# EAGLE design lumy (EAGLE 6.1)
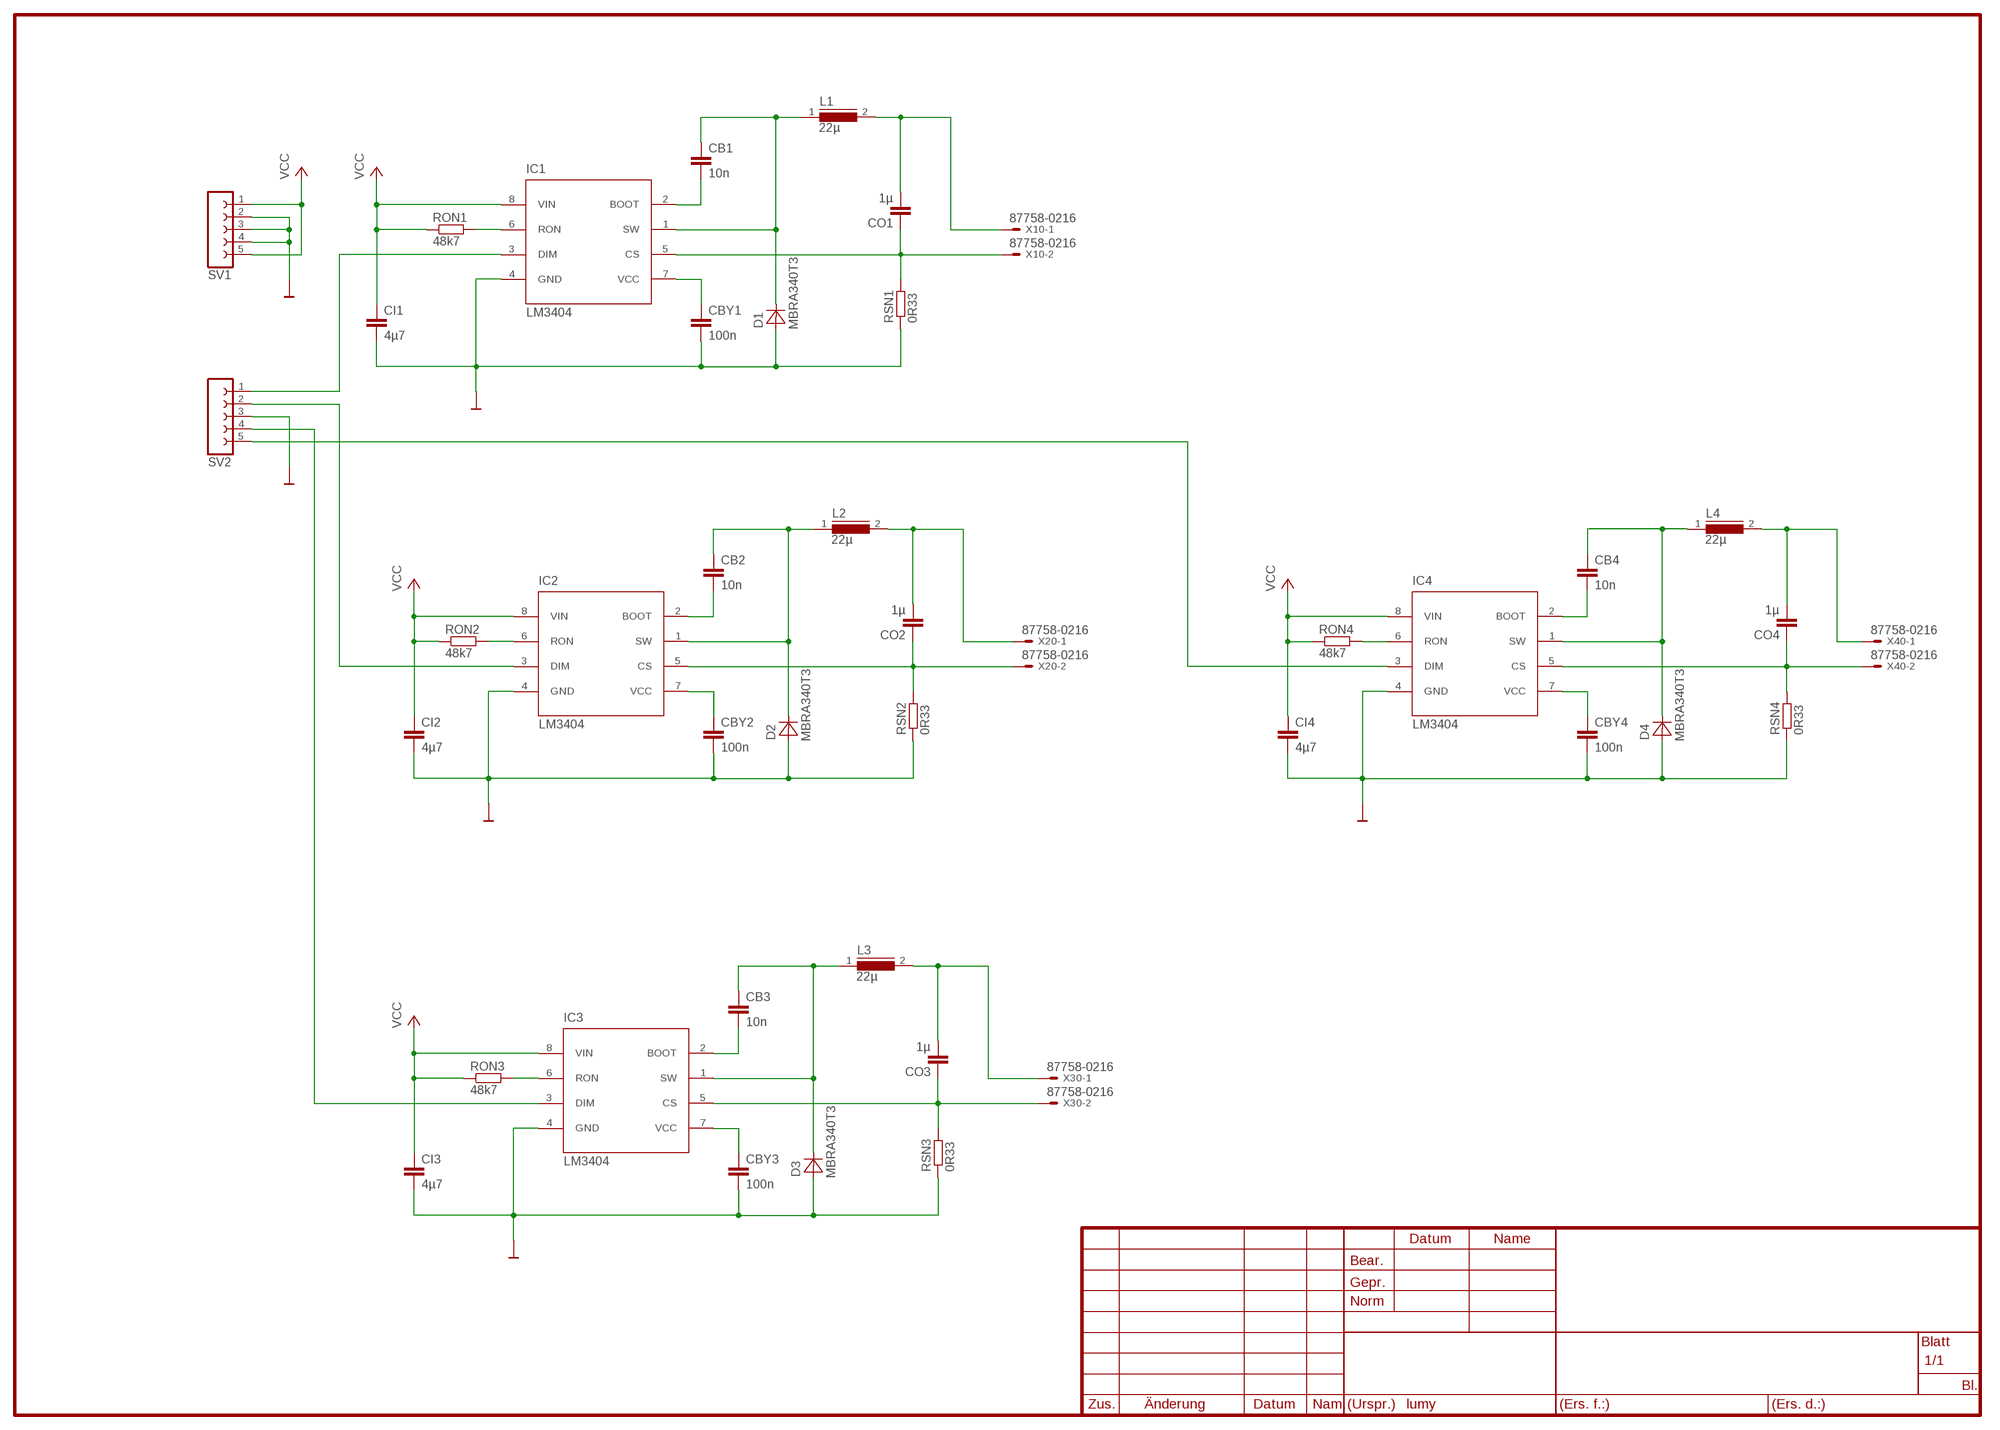
[diagram p0: schematic, sheet 1]

## Parts
CB1  10n  C-EUC0603  [C0603]
CB2  10n  C-EUC0603  [C0603]
CB3  10n  C-EUC0603  [C0603]
CB4  10n  C-EUC0603  [C0603]
CBY1  100n  C-EUC0603  [C0603]
CBY2  100n  C-EUC0603  [C0603]
CBY3  100n  C-EUC0603  [C0603]
CBY4  100n  C-EUC0603  [C0603]
CI1  4µ7  C-EUC0603  [C0603]
CI2  4µ7  C-EUC0603  [C0603]
CI3  4µ7  C-EUC0603  [C0603]
CI4  4µ7  C-EUC0603  [C0603]
CO1  1µ  C-EUC1206  [C1206]
CO2  1µ  C-EUC1206  [C1206]
CO3  1µ  C-EUC1206  [C1206]
CO4  1µ  C-EUC1206  [C1206]
D1  MBRA340T3  [SMA]
D2  MBRA340T3  [SMA]
D3  MBRA340T3  [SMA]
D4  MBRA340T3  [SMA]
IC1  LM3404  [SO08]
IC2  LM3404  [SO08]
IC3  LM3404  [SO08]
IC4  LM3404  [SO08]
L1  22µ  DR73  [DR73]
L2  22µ  DR73  [DR73]
L3  22µ  DR73  [DR73]
L4  22µ  DR73  [DR73]
RON1  48k7  R-EU_R0805  [R0805]
RON2  48k7  R-EU_R0805  [R0805]
RON3  48k7  R-EU_R0805  [R0805]
RON4  48k7  R-EU_R0805  [R0805]
RSN1  0R33  R-EU_R1206  [R1206]
RSN2  0R33  R-EU_R1206  [R1206]
RSN3  0R33  R-EU_R1206  [R1206]
RSN4  0R33  R-EU_R1206  [R1206]
SV1  FE05-1  [FE05-1]
SV2  FE05-1  [FE05-1]
X10  87758-0216  [87758-0216]
X20  87758-0216  [87758-0216]
X30  87758-0216  [87758-0216]
X40  87758-0216  [87758-0216]

## Nets
GND: CBY1.2 CBY2.2 CBY3.2 CBY4.2 CI1.2 CI2.2 CI3.2 CI4.2 D1.A D2.A D3.A D4.A IC1.4(GND) IC2.4(GND) IC3.4(GND) IC4.4(GND) RSN1.1 RSN2.1 RSN3.1 RSN4.1 SV1.2 SV1.3 SV1.4 SV2.3
N$1: IC1.6(RON) RON1.2
N$2: CB1.1 D1.C IC1.1(SW) L1.1
N$3: CBY1.1 IC1.7(VCC)
N$4: CO1.1 IC1.5(CS) RSN1.2 X10.2
N$5: CO1.2 L1.2 X10.1
N$6: CB1.2 IC1.2(BOOT)
N$7: IC1.3(DIM) SV2.1
N$8: IC2.6(RON) RON2.2
N$9: CBY2.1 IC2.7(VCC)
N$10: CO2.1 IC2.5(CS) RSN2.2 X20.2
N$11: CO2.2 L2.2 X20.1
N$12: CB2.1 D2.C IC2.1(SW) L2.1
N$13: CB2.2 IC2.2(BOOT)
N$14: IC2.3(DIM) SV2.2
N$15: IC3.6(RON) RON3.2
N$16: CBY3.1 IC3.7(VCC)
N$17: CO3.1 IC3.5(CS) RSN3.2 X30.2
N$18: CO3.2 L3.2 X30.1
N$19: CB3.1 D3.C IC3.1(SW) L3.1
N$20: CB3.2 IC3.2(BOOT)
N$21: IC3.3(DIM) SV2.4
N$23: CBY4.1 IC4.7(VCC)
N$24: CB4.2 IC4.2(BOOT)
N$25: IC4.6(RON) RON4.2
N$26: CB4.1 D4.C IC4.1(SW) L4.1
N$27: CO4.2 L4.2 X40.1
N$28: CO4.1 IC4.5(CS) RSN4.2 X40.2
N$30: IC4.3(DIM) SV2.5
VCC: CI1.1 CI2.1 CI3.1 CI4.1 IC1.8(VIN) IC2.8(VIN) IC3.8(VIN) IC4.8(VIN) RON1.1 RON2.1 RON3.1 RON4.1 SV1.1 SV1.5

## Library data of the parts
CB1-CB4 CBY1-CBY4 CI1-CI4 CO1-CO4 = rcl:C-EU: CAPACITOR, European symbol
D1-D4 = diode:MBRA340T3: Surface Mount Schottky Power Rectifier Source: http://www.onsemi.com/pub_link/Collateral/MBRA340T3-D.PDF
IC1-IC4 = national-semiconductor:LM3404: 1A Constant Current Buck Regulator for driving High Power LEDs
L1-L4 = inductors:DR73: High Power Density, High Efficiency, Shielded Inductors Source: coiltronics_dr_series.pdf
RON1-RON4 RSN1-RSN4 = rcl:R-EU_: RESISTOR, European symbol
SV1 SV2 = con-lsta:FE05-1: FEMALE HEADER; OC_FARNELL: unknown; OC_NEWARK: unknown
X10 X20 X30 X40 = con-molex:87758-0216: 2 Pin - 2mm Dual Row Single Wafer, Vertical T/H HDR Source: http://www.molex.com/pdm_docs/sd/877580616_sd.pdf; MPN: 87758-0216; OC_FARNELL: unknown; OC_NEWARK: 94M1513

## Board
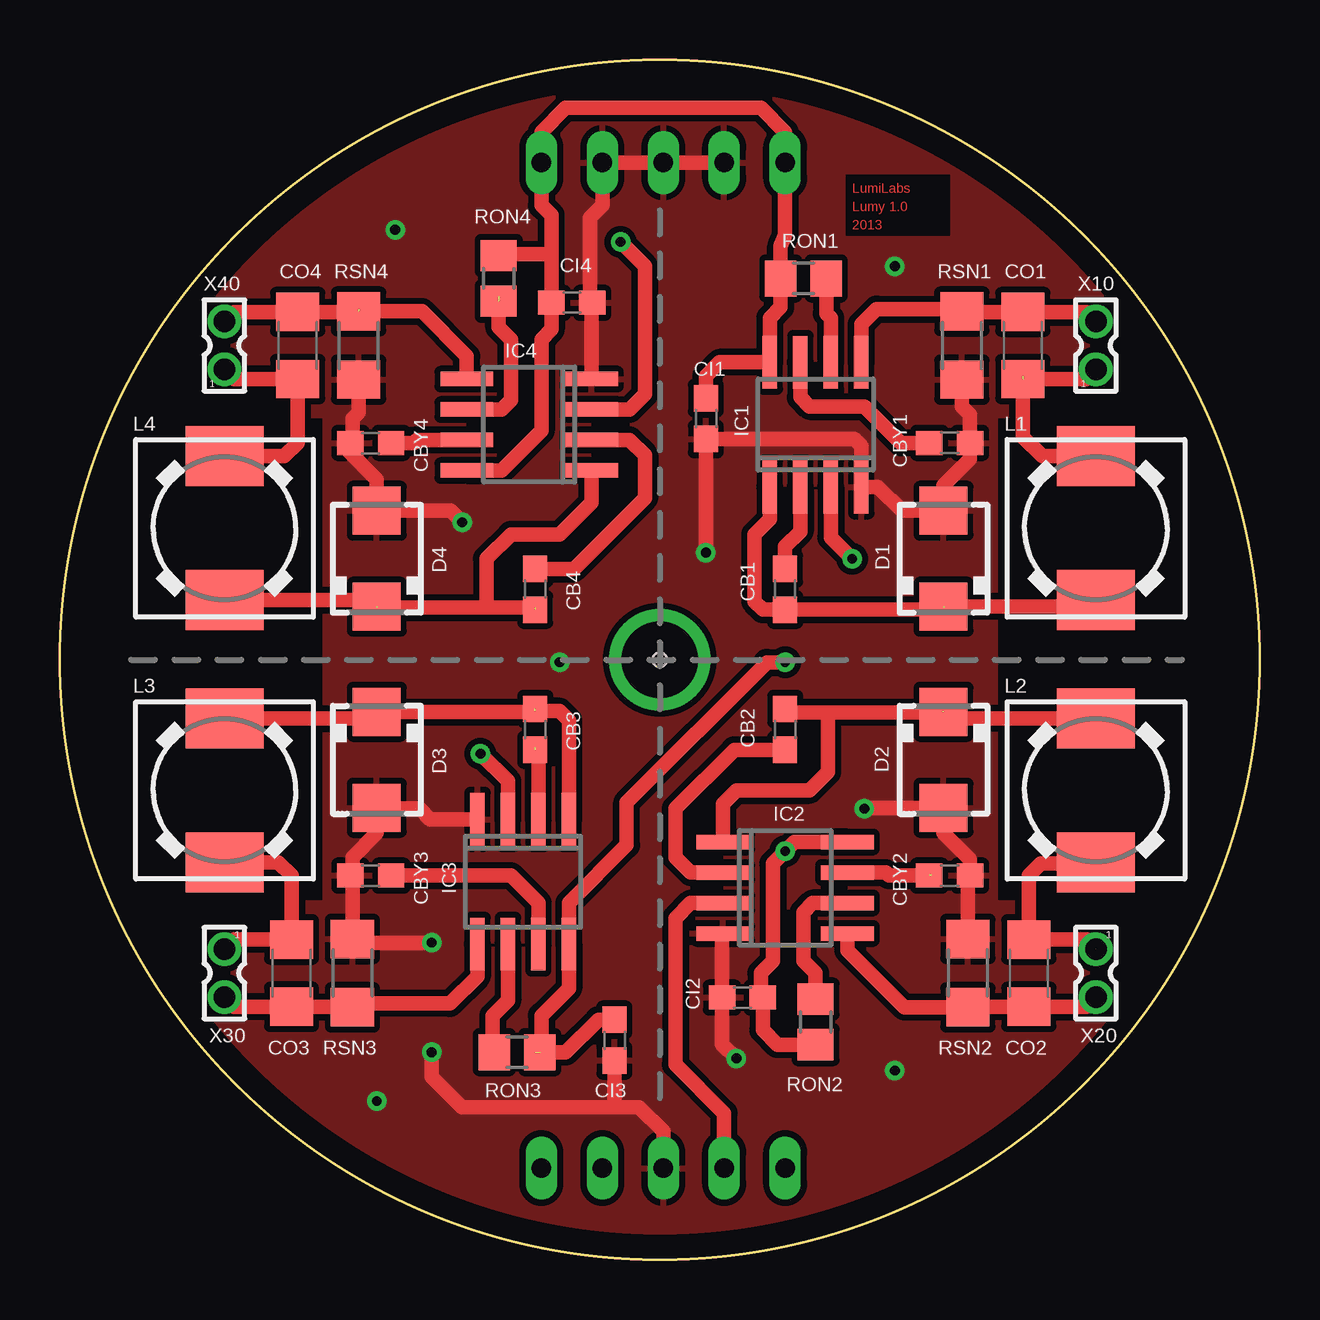
[diagram p1: board, top side]
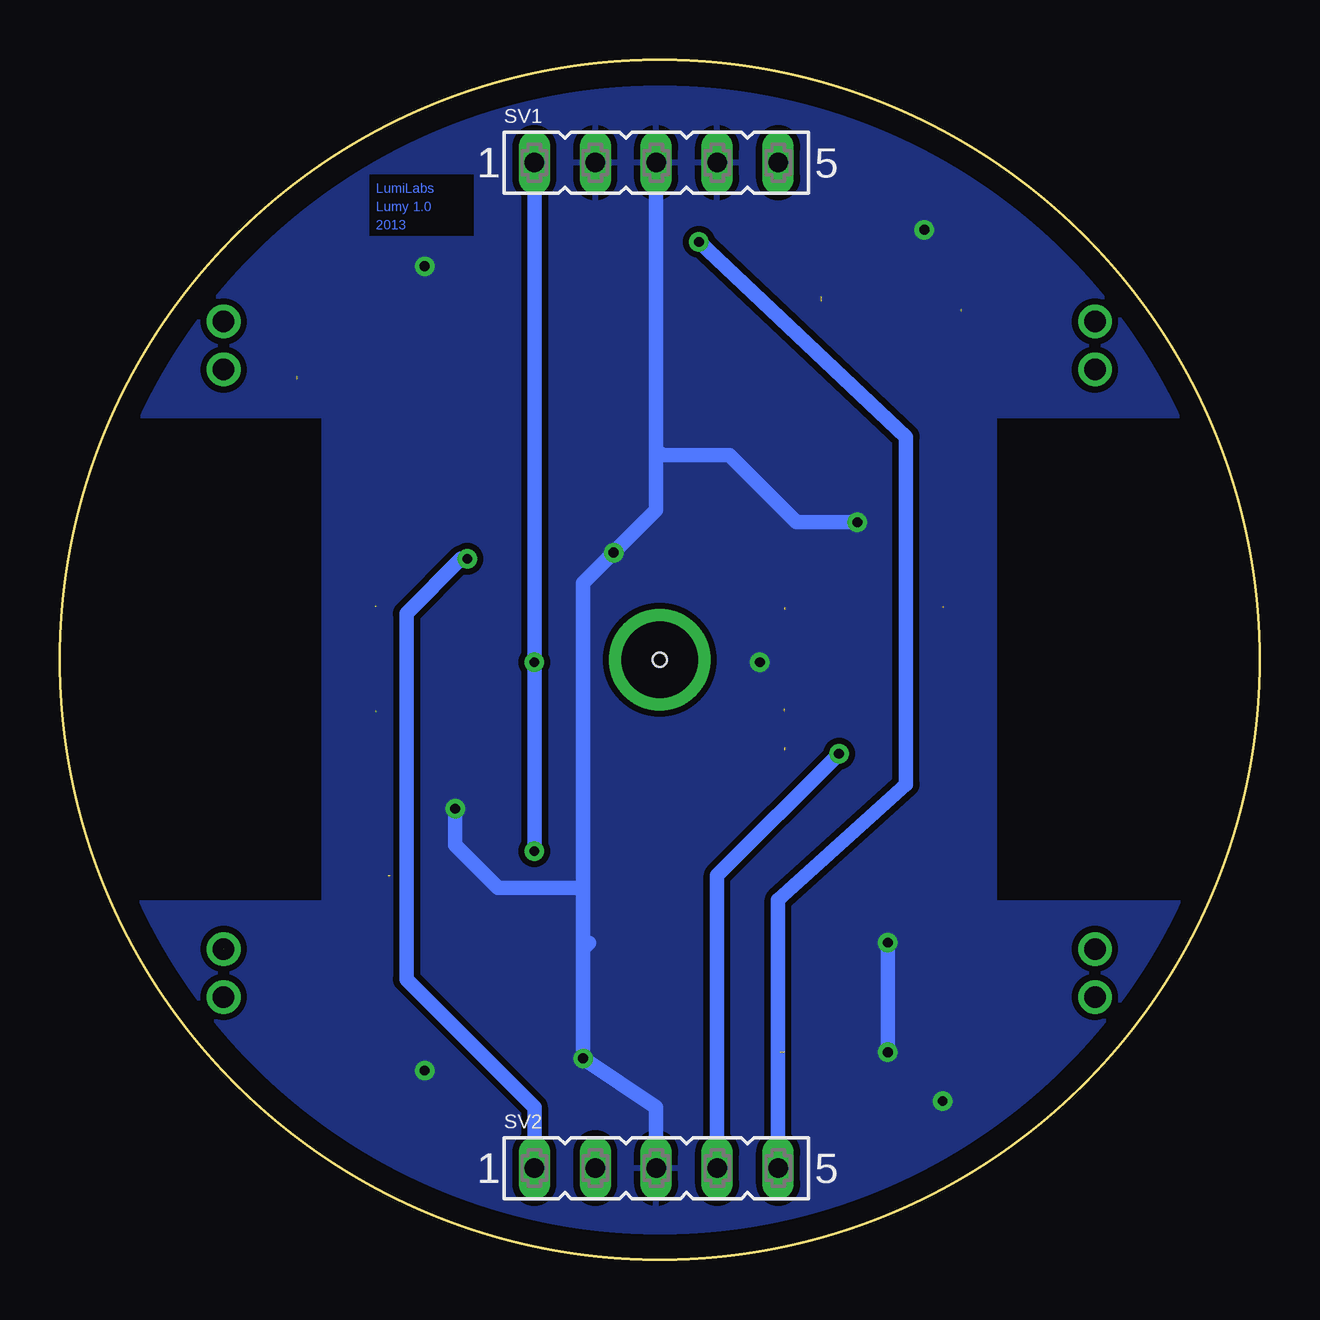
[diagram p2: board, bottom side, seen from below]

Size 50 x 50 mm. Coordinates in mm from the lower left corner, seen from the top.
Outline: circle at 25,25 radius 25
Copper layers (1*16): Top 0.035mm / dielectric 1.5mm / Bottom 0.035mm
Design rules: minimum track width 10mil, minimum drill 10mil, track to track 10mil, track to pad 10mil, pad to pad 10mil, via to via 10mil, smd to smd 10mil, copper to edge 40mil, drill to drill 8mil, minimum pad ring 10mil, minimum via ring 8mil, stop-mask expansion 4mil, vias tented up to drill 0mil, thermal gap 10mil
Holes 0.6 mm at 25,25
tRestrict: area 3,15 to 10.9,35.1; area 39.1,15 to 47,35.1; area 32.8,42.7 to 37.1,45.2
bRestrict: area 3,15 to 10.9,35.1; area 39.1,15 to 47,35.1; area 32.8,42.7 to 37.1,45.2

### Footprints (pad centres in the part's own frame; a part is rotated, then mirrored left to right if it is on the bottom)
C0603 = smd 1.1 x 1: 1 -0.85,0; 2 0.85,0
C1206 = smd 1.6 x 1.8: 1 -1.4,0; 2 1.4,0
SMA = smd 2 x 2: A 2,0; C -2,0
SO08 = smd 0.6 x 2.2: 1 -1.905,-2.6; 2 -0.635,-2.6; 3 0.635,-2.6; 4 1.905,-2.6; 5 1.905,2.6; 6 0.635,2.6; 7 -0.635,2.6; 8 -1.905,2.6
DR73 = smd 2.5 x 3.25: 1 -3,0; 2 3,0
R0805 = smd 1.3 x 1.5: 1 -0.95,0; 2 0.95,0
R1206 = smd 1.6 x 1.803: 1 -1.422,0; 2 1.422,0
FE05-1 = drill 0.813 long: 1 -5.08,0; 2 -2.54,0; 3 0,0; 4 2.54,0; 5 5.08,0
87758-0216 = drill 0.9 pad 1.27: 1 0,-1; 2 0,1

### Placement (x,y rotation side)
CB1  30.23,27.94 90 top
CB2  30.23,22.1 270 top
CB3  19.81,22.1 270 top
CB4  19.81,27.94 90 top
CBY1  37.08,34.04 0 top
CBY2  37.08,16 0 top
CBY3  12.95,16 180 top
CBY4  12.95,34.04 180 top
CI1  26.92,35.05 270 top
CI2  28.45,10.92 180 top
CI3  23.11,9.14 270 top
CI4  21.34,39.88 0 top
CO1  40.13,38.1 270 top
CO2  40.39,11.94 90 top
CO3  9.65,11.94 90 top
CO4  9.91,38.1 270 top
D1  36.83,29.21 90 top
D2  36.83,20.83 270 top
D3  13.21,20.83 270 top
D4  13.21,29.21 90 top
IC1  31.5,34.8 0 top
IC2  30.23,15.49 270 top
IC3  19.3,15.75 180 top
IC4  19.56,34.8 90 top
L1  43.18,30.48 90 top
L2  43.18,19.56 270 top
L3  6.86,19.56 270 top
L4  6.86,30.48 90 top
RON1  30.99,40.89 0 top
RON2  31.5,9.91 90 top
RON3  19.05,8.64 180 top
RON4  18.29,40.89 270 top
RSN1  37.59,38.1 90 top
RSN2  37.85,11.94 270 top
RSN3  12.19,11.94 270 top
RSN4  12.45,38.1 90 top
SV1  25.15,45.72 0 bottom
SV2  25.15,3.81 0 bottom
X10  43.18,38.1 0 top
X20  43.18,11.94 180 top
X30  6.86,11.94 180 top
X40  6.86,38.1 0 top

### Tracks (layer width: path | path; a pad name or v marks a point on that pad's centre or on a via)
GND  (via drill 0.41)
  Top 0.406: 37.85,15.84 CBY2.2
  Top 0.61: RSN1.1 37.59,35.56 37.93,35.22 CBY1.2 37.93,33.36 36.83,32.26 D1.A 35.08,31.21 34.1,32.2 IC1.4 33.4,33.91 33.11,34.2 CI1.2 v26.92,29.46 | RSN2.1 37.85,16 | CBY2.2 37.93,16.68 36.83,17.78 D2.A 33.56,18.83 v33.53,18.8 | IC2.4 27.6,13.56 CI2.2 27.6,8.98 v28.19,8.38 | 12.19,16 RSN3.1 12.34,13.21 v15.49,13.21 | CBY3.2 12.19,16.09 12.19,16.76 13.21,17.78 D3.A 13.24,18.8 14.99,18.8 15.43,18.35 IC3.4 | v15.49,8.64 15.49,7.62 16.76,6.35 23.11,6.35 | CI3.2 23.11,6.35 | 23.11,6.35 24.13,6.35 25.15,5.33 SV2.3 | SV1.2 SV1.3 SV1.4 22.61,43.94 22.1,43.43 22.1,39.88 22.16,39.82 IC4.4 | RSN4.1 12.45,35.31 12.19,35.05 12.19,34.29 11.94,34.04 11.94,33.78 13.21,32.51 13.21,31.24 | D4.A 16.29,31.21 v16.76,30.73
  Bottom 0.61: 28.19,15.49 28.19,28.19 v26.92,29.46 25.15,31.24 25.15,33.78 | 28.19,15.49 28.19,12.95 | 28.19,12.95 v28.19,8.38 25.15,6.35 SV2.3 | SV1.3 25.15,33.78 | v33.53,18.8 33.53,17.27 31.75,15.49 28.19,15.49 | 27.94,13.21 28.19,12.95 | v15.49,13.21 v15.49,8.64 | v16.76,30.73 19.3,30.73 22.1,33.53 24.89,33.53 25.15,33.78
  other vias: 13.97,42.93 34.8,41.4 34.8,7.87 13.21,6.6 20.83,24.89
  pour Top: 0.25,24.89 arc-90 25.15,49.78 25.4,49.78 arc-90 49.78,25.4 49.78,24.64 arc-90 25.4,0.25 24.89,0.25 arc-90
  pour Bottom: 0.25,24.89 arc-90 25.15,49.78 25.4,49.78 arc-90 49.78,25.4 49.78,24.64 arc-90 25.4,0.25 24.89,0.25 arc-90
N$1
  Top 0.61: IC1.6 32.13,39.24 31.94,39.44 RON1.2
N$2  (1 unrouted)
  Top 0.61: 43.43,27.43 43.18,27.43 L1.1 | 43.18,27.69 L1.1 | L1.1 42.91,27.21 36.86,27.21 36.83,27.18 | D1.C 36.71,27.09 CB1.1 29.3,27.09 28.96,27.43 28.96,30.23 29.59,30.86 IC1.1
N$3
  Top 0.61: IC1.7 30.86,35.94 31.24,35.56 33.53,35.56 35.05,34.04 CBY1.1
N$4
  Top 0.61: X10.2 42.78,39.5 CO1.1 37.61,39.5 RSN1.2 37.49,39.62 34.04,39.62 33.4,38.99 IC1.5
N$5  (1 unrouted)
  Top 0.61: CO1.2 42.78,36.7 X10.1 | L1.2 40.94,33.48 40.13,34.29 40.13,36.83
N$6
  Top 0.61: CB1.2 30.23,29.72 30.86,30.35 IC1.2
N$7  (via drill 0.41)
  Top 0.61: IC1.3 32.13,30.1 v33.02,29.21
  Bottom 0.61: v33.02,29.21 33.27,29.21 35.56,26.92 35.56,11.68 30.23,6.35 SV2.1
N$8
  Top 0.61: RON2.2 31.5,11.94 30.99,12.45 30.99,14.48 31.37,14.86 IC2.6
N$9  (1 unrouted)
  Top 0.61: IC2.7 34.42,16.13 34.54,16 36.32,16
N$10
  Top 0.61: X20.2 42.78,10.54 CO2.1 37.87,10.54 RSN2.2 35.2,10.52 32.83,12.89 IC2.5
N$11  (1 unrouted)
  Top 0.61: 43.18,12.95 42.8,13.34 CO2.2 40.39,16 40.89,16.51 43.13,16.51 L2.2
N$12  (1 unrouted)
  Top 0.61: D2.C 36.85,22.81 32,22.81 | L2.1 37.13,22.56 36.83,22.86 | 30.36,22.81 CB2.1 30.23,22.81 32,22.81 | IC2.1 27.63,18.99 28.19,19.56 31.24,19.56 32,20.32 32,22.81
N$13
  Top 0.61: IC2.2 26.29,16.13 25.65,16.76 25.65,18.8 28.11,21.25 CB2.2
N$14
  Top 0.61: SV2.2 27.69,6.1 25.65,8.13 25.65,14.22 26.29,14.86 IC2.3
N$15
  Top 0.61: IC3.6 18.67,10.79 18.03,10.16 18.03,8.7 RON3.2
N$16
  Top 0.61: CBY3.1 18.8,16 19.94,14.86 IC3.7
N$17
  Top 0.61: X30.2 7.26,10.54 CO3.1 12.17,10.54 RSN3.2 12.34,10.67 16.26,10.67 17.4,11.81 IC3.5
N$18
  Top 0.61: X30.1 7.26,13.34 CO3.2 9.65,16 9.1,16.56 L3.2
N$19  (1 unrouted)
  Top 0.61: L3.1 12.94,22.56 D3.C 19.78,22.83 | 19.75,22.8 19.78,22.83 | IC3.1 21.21,22.48 20.83,22.86 19.9,22.86 CB3.1 | 19.78,22.83 19.81,22.86
N$20  (1 unrouted)
  Top 0.61: IC3.2 19.94,21.21 19.81,21.34
N$21  (via drill 0.41)
  Top 0.61: IC3.3 18.67,19.94 v17.53,21.08
  Bottom 0.61: SV2.4 22.61,16 v17.53,21.08
N$23
  Top 0.61: IC4.7 14.86,34.16 14.73,34.04 CBY4.1
N$24
  Top 0.61: CB4.2 21.42,28.79 24.38,31.75 24.38,33.53 23.75,34.16 IC4.2
N$25  (1 unrouted)
  Top 0.61: IC4.6 18.41,35.43 18.8,35.81 18.8,38.35 18.29,38.86 18.29,40.13
N$26  (2 unrouted)
  Top 0.61: L4.1 12.91,27.48 13.21,27.18 17.78,27.18 | 17.78,27.18 19.81,27.18 | IC4.1 22.16,31.56 20.83,30.23 18.8,30.23 17.78,29.21 17.78,27.18
N$27
  Top 0.61: X40.1 7.26,36.7 CO4.2 9.91,34.04 9.35,33.48 L4.2
N$28  (1 unrouted)
  Top 0.61: 12.45,39.62 12.32,39.5 CO4.1 7.26,39.5 X40.2 | RSN4.2 15.09,39.52 16.96,37.65 IC4.5
N$29  (via drill 3.2)
  other vias: 25,25
N$30  (via drill 0.41)
  Top 0.61: IC4.3 23.75,35.43 24.38,36.07 24.38,41.4 v23.37,42.42
  Bottom 0.61: SV2.5 20.07,14.99 14.73,19.81 14.73,34.29 v23.37,42.42
VCC  (via drill 0.41)  (1 unrouted)
  Top 0.61: RON2.1 29.91,8.96 29.3,9.56 CI2.1 29.21,11.01 29.21,11.94 29.72,12.45 29.72,16.51 v30.23,17.02 30.61,17.4 IC2.8 | CI1.1 26.92,36.83 27.49,37.4 IC1.8 29.59,39.24 30.04,39.69 RON1.1 30.04,42.23 30.23,42.67 SV1.1 30.23,46.99 29.21,48.01 21.08,48.01 20.07,46.99 SV1.5 20.07,43.94 20.49,43.52 20.49,41.91 | RON3.1 20.07,8.7 20.07,10.16 21.21,11.3 IC3.8 21.21,14.86 23.62,17.27 23.62,19.05 29.46,24.89 v30.23,24.89 | CI3.1 22.44,9.99 21.08,8.64 19.81,8.64 | IC4.8 18.41,32.89 20.07,34.54 20.07,38.35 20.49,38.77 CI4.1 20.49,41.91 | RON4.1 18.35,41.91 20.49,41.91
  Bottom 0.61: SV1.1 v30.23,24.89 v30.23,17.02

### Text on the board
Top: LumiLabs | Lumy 1.0 | 2013
Bottom: LumiLabs | Lumy 1.0 | 2013